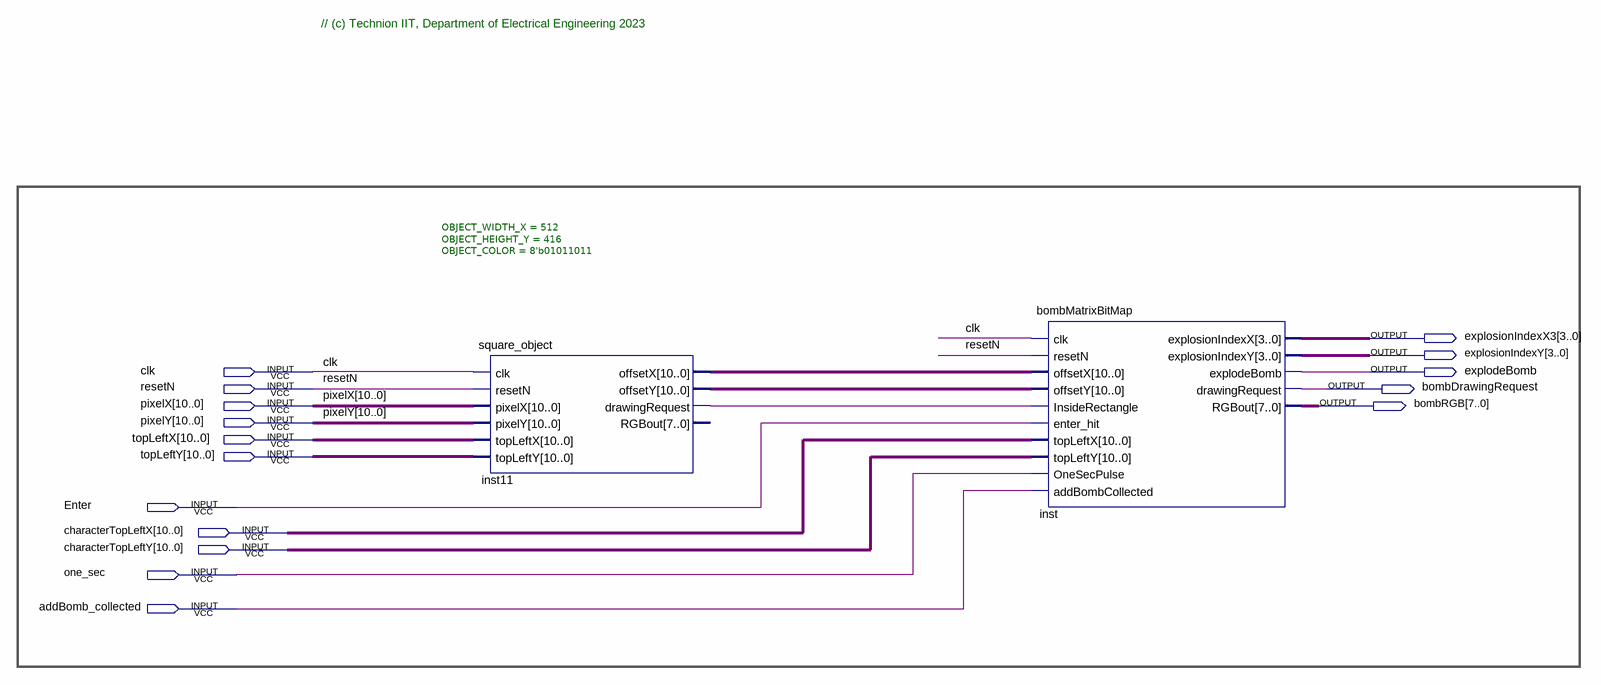
[diagram p0: schematic sheet]
// Quartus schematic BOMB_DISPLAY2.bdf as structural Verilog: 2 symbols, 16 pins
module BOMB_DISPLAY2 (
  input  clk,
  input  resetN,
  input  [10:0] pixelX,
  input  [10:0] pixelY,
  input  [10:0] topLeftX,
  input  [10:0] topLeftY,
  input  Enter,
  input  [10:0] characterTopLeftX,
  input  [10:0] characterTopLeftY,
  input  one_sec,
  input  addBomb_collected,
  output [3:0] explosionIndexX3,
  output [3:0] explosionIndexY,
  output explodeBomb,
  output bombDrawingRequest,
  output [7:0] bombRGB
);

  wire inst11_drawingrequest;
  wire [10:0] inst11_offsetx, inst11_offsety;

  square_object #(.OBJECT_WIDTH_X(512), .OBJECT_HEIGHT_Y(416), .OBJECT_COLOR(8'b01011011)) inst11 (
    .clk(clk), .resetN(resetN), .pixelX(pixelX), .pixelY(pixelY), .topLeftX(topLeftX), .topLeftY(topLeftY),
    .offsetX(inst11_offsetx), .offsetY(inst11_offsety), .drawingRequest(inst11_drawingrequest));  // open: RGBout
  bombMatrixBitMap inst (
    .clk(clk), .resetN(resetN), .offsetX(inst11_offsetx), .offsetY(inst11_offsety),
    .InsideRectangle(inst11_drawingrequest), .enter_hit(Enter), .topLeftX(characterTopLeftX),
    .topLeftY(characterTopLeftY), .OneSecPulse(one_sec), .addBombCollected(addBomb_collected),
    .explosionIndexX(explosionIndexX3), .explosionIndexY(explosionIndexY), .explodeBomb(explodeBomb),
    .drawingRequest(bombDrawingRequest), .RGBout(bombRGB));

  // Notes on the sheet:
  //   // (c) Technion IIT, Department of Electrical Engineering 2023
endmodule
